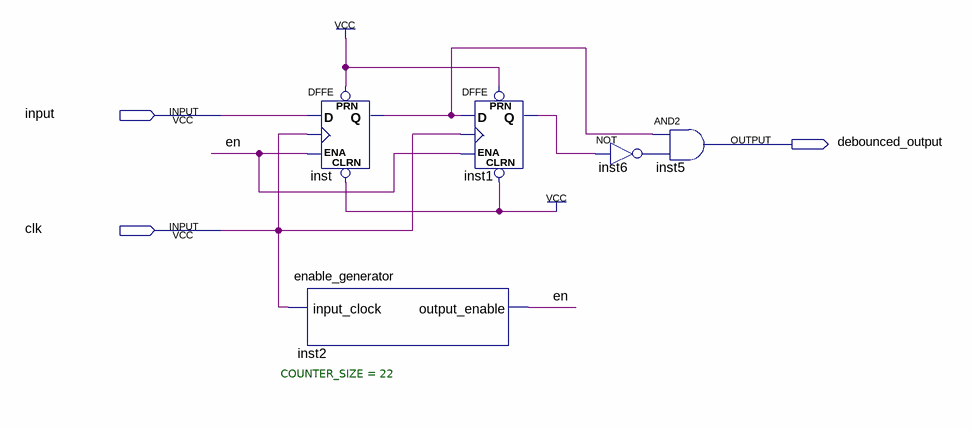
[diagram p0: schematic sheet]
// Quartus schematic edge_triggered_debouncer.bdf as structural Verilog: 5 symbols, 3 pins
module edge_triggered_debouncer (
  input  \input ,
  input  clk,
  output debounced_output
);

  wire en, inst1_q, inst6_out, inst_q;

  enable_generator #(.COUNTER_SIZE(22)) inst2 (.input_clock(clk), .output_enable(en));
  DFFE inst (.PRN(1'b1), .CLRN(1'b1), .D(\input ), .CLK(clk), .ENA(en), .Q(inst_q));
  DFFE inst1 (.PRN(1'b1), .CLRN(1'b1), .D(inst_q), .CLK(clk), .ENA(en), .Q(inst1_q));
  not inst6 (inst6_out, inst1_q);
  and inst5 (debounced_output, inst_q, inst6_out);
endmodule
